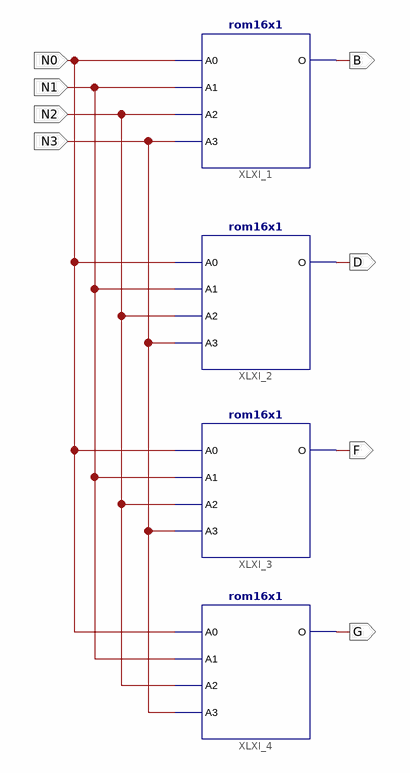
[diagram p0: schematic sheet 1]
// Xilinx ISE schematic ROM_BDFG.sch (spartan3e) as structural Verilog: 4 symbols, 8 ports
module ROM_BDFG (
  input  N0,
  input  N1,
  input  N2,
  input  N3,
  output B,
  output D,
  output F,
  output G
);

  rom16x1 #(.INIT("D860")) XLXI_1 (.A0(N0), .A1(N1), .A2(N2), .A3(N3), .O(B));
  rom16x1 #(.INIT("8492")) XLXI_2 (.A0(N0), .A1(N1), .A2(N2), .A3(N3), .O(D));
  rom16x1 #(.INIT("208E")) XLXI_3 (.A0(N0), .A1(N1), .A2(N2), .A3(N3), .O(F));
  rom16x1 #(.INIT("1083")) XLXI_4 (.A0(N0), .A1(N1), .A2(N2), .A3(N3), .O(G));
endmodule
